# Altium schematic sheet Sheet1.SchDoc
size A; SheetNumber: 1; SheetTotal: 1; SPICEModelCacheGYLIFTHO: <root> / <DocumentId>GYLIFTHO</DocumentId> / <CacheFrame Number="0"> / <Model Name="1n5408" Kind="MDL"> / <Text>*1N5408 MCE 8/5/97 / *Ref: International Rectifier Digest '94 / *1000V 3000mA 3us Si Diode pkg:DIODE0.4 1,2 / .MODEL 1N5408 D (IS=4.26N RS=14M N=1.7 BV=1E+03 IBV=165U / + CJO=125P VJ=0.75 M=0.333 TT=4.32U)</Text> / </Model> / <Model Name="1n4007" Kind="MDL"> / <Text>*1N4007 MCE 8-16-95 / *1000V 1A Si GenPurpose Diode pkg:DIODE0.4 1,2 / .MODEL 1N4007 D(IS=2.55E-9 RS=0.042 N=1.75 TT=5.76E-6 CJO=1.85E-11 / + VJ=0.75 M=0.333 BV=1000 IBV=9.86E-5 )</Text> / </Model> / <Model Name="cap" Kind="MDL"> / <Text>*Default semiconductor capacitor / .MODEL CAP C()</Text> / </Model> / </CacheFrame> / </root>
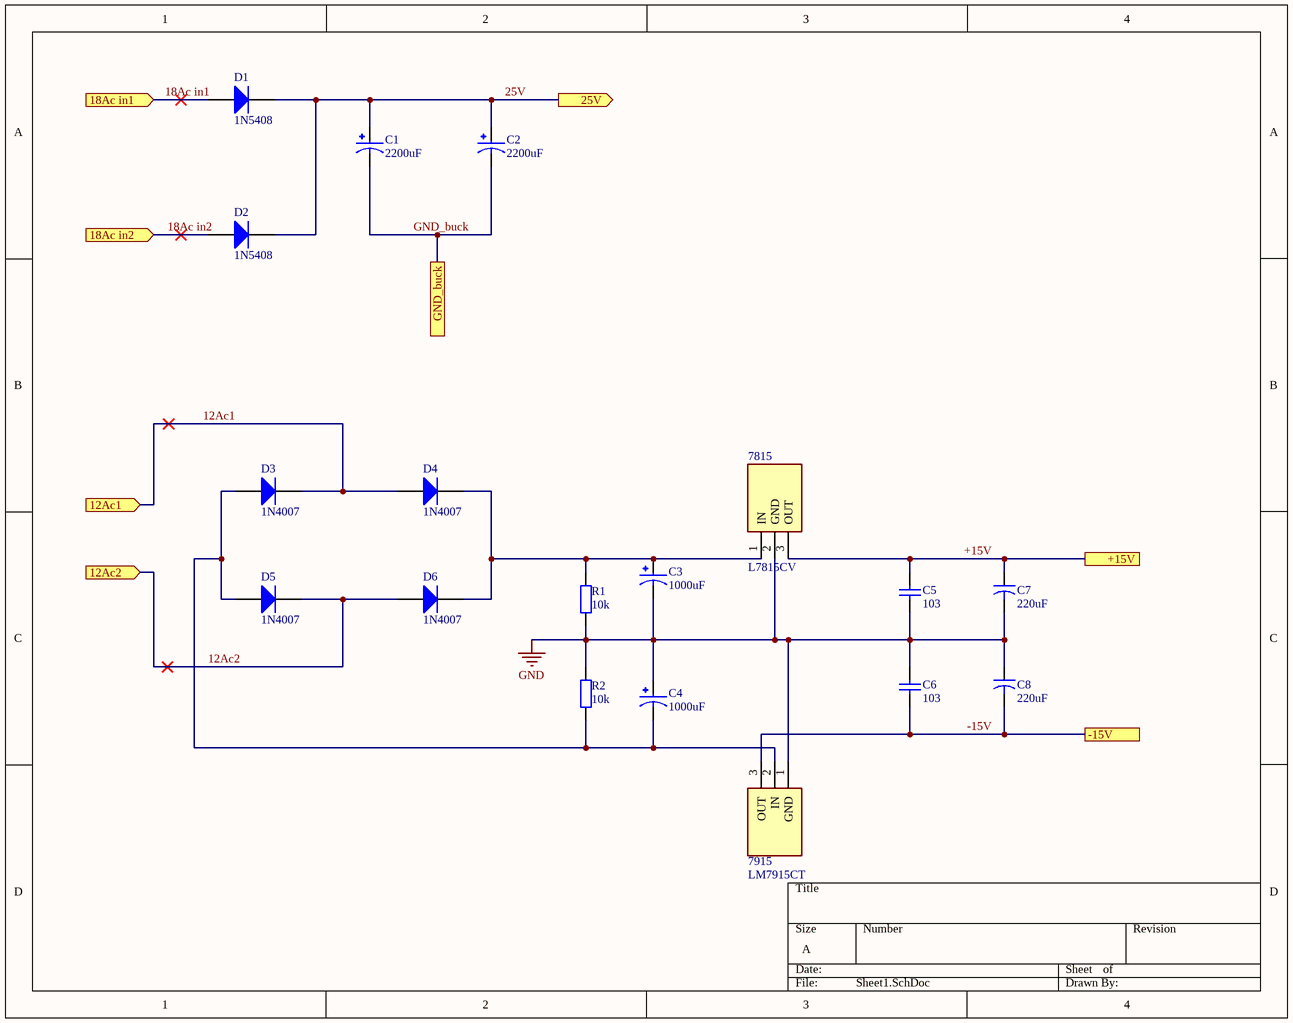
[diagram p0: Sheet1.SchDoc]

## Parts
7815  L7815CV  [TO270P460X1020X2008-3P]
7915  LM7915CT  [TO254P470X1016X2019-3P]
C1  2200uF  [CAPPRD500W60D1250H2500]
C2  2200uF  [CAPPRD500W60D1250H2500]
C3  1000uF  [CAPPRD500W60D1250H2500]
C4  1000uF  [CAPPRD500W60D1250H2500]
C5  103  [CAP_DE2E3SA103MA3BT02F]
C6  103  [CAP_DE2E3SA103MA3BT02F]
C7  220uF  [CAPR5-4X5]
C8  220uF  [CAPR5-4X5]
D1  1N5408  [DO-201AD]
D2  1N5408  [DO-201AD]
D3  1N4007  [DO-41]
D4  1N4007  [DO-41]
D5  1N4007  [DO-41]
D6  1N4007  [DO-41]
R1  10k  [AXIAL-0.4]
R2  10k  [AXIAL-0.4]

## Ports
12Ac1 (in), 12Ac2 (in), 18Ac in1 (in), 18Ac in2 (in), 25V (out), +15V, -15V, GND_buck

## Nets
GND: 7815.2(GND) 7915.1(GND) C3.N C4.P C5.1 C6.2 C7.2 C8.1 R1.1 R2.2
12Ac1: D3.2(K) D4.1(A) ; port 12Ac1
12Ac2: D5.2(K) D6.1(A) ; port 12Ac2
18Ac in1: D1.1(A) ; port 18Ac in1
18Ac in2: D2.1(A) ; port 18Ac in2
25V: C1.P C2.P D1.2(K) D2.2(K) ; port 25V
+15V: 7815.3(OUT) C5.2 C7.1 ; port +15V
-15V: 7915.3(OUT) C6.1 C8.2 ; port -15V
GND_buck: C1.N C2.N ; port GND_buck
Net7815_1: 7815.1(IN) C3.P D4.2(K) D6.2(K) R1.2
Net7915_2: 7915.2(IN) C4.N D3.1(A) D5.1(A) R2.1

## Library data of the parts
7815 = L7815CV: L7815CV, Voltage Regulator, 1.5A 15 V, 3-Pin TO-220; Manufacturer_Name: STMicroelectronics; Geometry.Height: 4.6mm; Manufacturer_Part_Number: L7815CV; Mouser Part Number: 511-L7815CV; Mouser Price/Stock: https://www.mouser.co.uk/ProductDetail/STMicroelectronics/L7815CV?qs=htKRmzjvioQnqIcNFSQfsw%3D%3D; Arrow Part Number: L7815CV; Arrow Price/Stock: https://www.arrow.com/en/products/l7815cv/stmicroelectronics?region=europe; Mouser Testing Part Number: *; Mouser Testing Price/Stock: *; Datasheet Link: http://www.st.com/web/en/resource/technical/document/datasheet/CD00000444.pdf
7915 = LM7915CT: ON Semiconductor LM7915CT Negative Voltage Regulator, 1A, -15 V, +/-4% 3-Pin, TO-220; Manufacturer_Name: onsemi; Geometry.Height: 4.7mm; Manufacturer_Part_Number: LM7915CT; Mouser Part Number: 512-LM7915CT; Mouser Price/Stock: https://www.mouser.co.uk/ProductDetail/ON-Semiconductor-Fairchild/LM7915CT?qs=AxPfoIcMNKKE4cliBai9zA%3D%3D; Arrow Part Number: LM7915CT; Arrow Price/Stock: https://www.arrow.com/en/products/lm7915ct/on-semiconductor; Mouser Testing Part Number: *; Mouser Testing Price/Stock: *; Datasheet Link: https://datasheet.datasheetarchive.com/originals/distributors/Datasheets_SAMA/07f7f5cfa7b45aeaa7d93e4c14459954.pdf
C1 C2 = EEUFM1C222: 2200ÂµF 16V Aluminum Electrolytic Capacitors Radial, Can 7000 Hrs @ 105Â°C; MF: Panasonic; Purchase-URL: https://pricing.snapeda.com/search/part/EEUFM1C222/?ref=eda; MP: EEUFM1C222; Value: *; Availability: In Stock; Check_prices: https://www.snapeda.com/parts/EEUFM1C222/Panasonic/view-part/?ref=eda; SnapEDA_Link: https://www.snapeda.com/parts/EEUFM1C222/Panasonic/view-part/?ref=snap; Price: None; Package: RADIAL-2 Panasonic
C3 C4 = EEUHD1H102B: CAP ALUM 1000UF 20% 50V RADIAL; MF: Panasonic; MP: EEU-HD1H102B; Availability: In Stock; Check_prices: https://www.snapeda.com/parts/EEU-HD1H102B/Panasonic/view-part/2335470/?ref=eda; Package: RADIAL-2 Panasonic; Price: None; SnapEDA_Link: https://www.snapeda.com/parts/EEU-HD1H102B/Panasonic/view-part/2335470/?ref=snap; Value: *
C5 C6 = Cap: Capacitor; Value: 100pF; Published: 8-Jun-2000; LatestRevisionDate: 17-Jul-2002; LatestRevisionNote: Re-released for DXP Platform.; PackageReference: RAD-0.3; Publisher: Altium Limited; PackageDescription: Radial Cap, Thru-Hole; 2 Leads; 0.3 in Pin Spacing
C7 C8 = Cap2: Capacitor; Value: 100pF; Published: 23-Sep-2002; PackageReference: CAPR5-4X5; Publisher: Altium Limited; PackageDescription: Capacitor; 2 Leads
D1 D2 = Diode 1N5408: 3 Amp Medium Power Silicon Rectifier Diode; Published: 8-Jun-2000; LatestRevisionDate: 17-Jul-2002; LatestRevisionNote: Re-released for DXP Platform.; DatasheetVersion: Aug-1984; PackageReference: DO-201AD; Publisher: Altium Limited; PackageDescription: Diode, Axial; Body 9.5 x 5.3 mm (LxDia. max), Lead Dia. 1.32 mm (max); ComponentLink1Description: Manufacturer Link; ComponentLink1URL: http://www.irf.com/
D3-D6 = Diode 1N4007: 1 Amp General Purpose Rectifier; Published: 8-Jun-2000; LatestRevisionDate: 17-Jul-2002; LatestRevisionNote: Re-released for DXP Platform.; DatasheetVersion: 1998; PackageVersion: Aug-1999; PackageReference: DO-41; Publisher: Altium Limited; PackageDescription: Diode, Axial; Body 5.2 x 2.7 mm (LxDia. max), Lead Dia. 0.86 mm (max); Code_JEDEC: DO-204-AL; ComponentLink1Description: Manufacturer Link; ComponentLink1URL: http://www.fairchildsemi.com/; ComponentLink2Description: Datasheet; ComponentLink2URL: http://www.fairchildsemi.com/ds/1N%2F1N4001.pdf
R1 R2 = Res2: Resistor; Value: 1K; Published: 8-Jun-2000; LatestRevisionDate: 17-Jul-2002; LatestRevisionNote: Re-released for DXP Platform.; PackageReference: AXIAL-0.4; Publisher: Altium Limited; PackageDescription: Axial Device, Thru-Hole; 2 Leads; 0.4 in Pin Spacing